# EAGLE design pcb_1 (EAGLE 5.06)
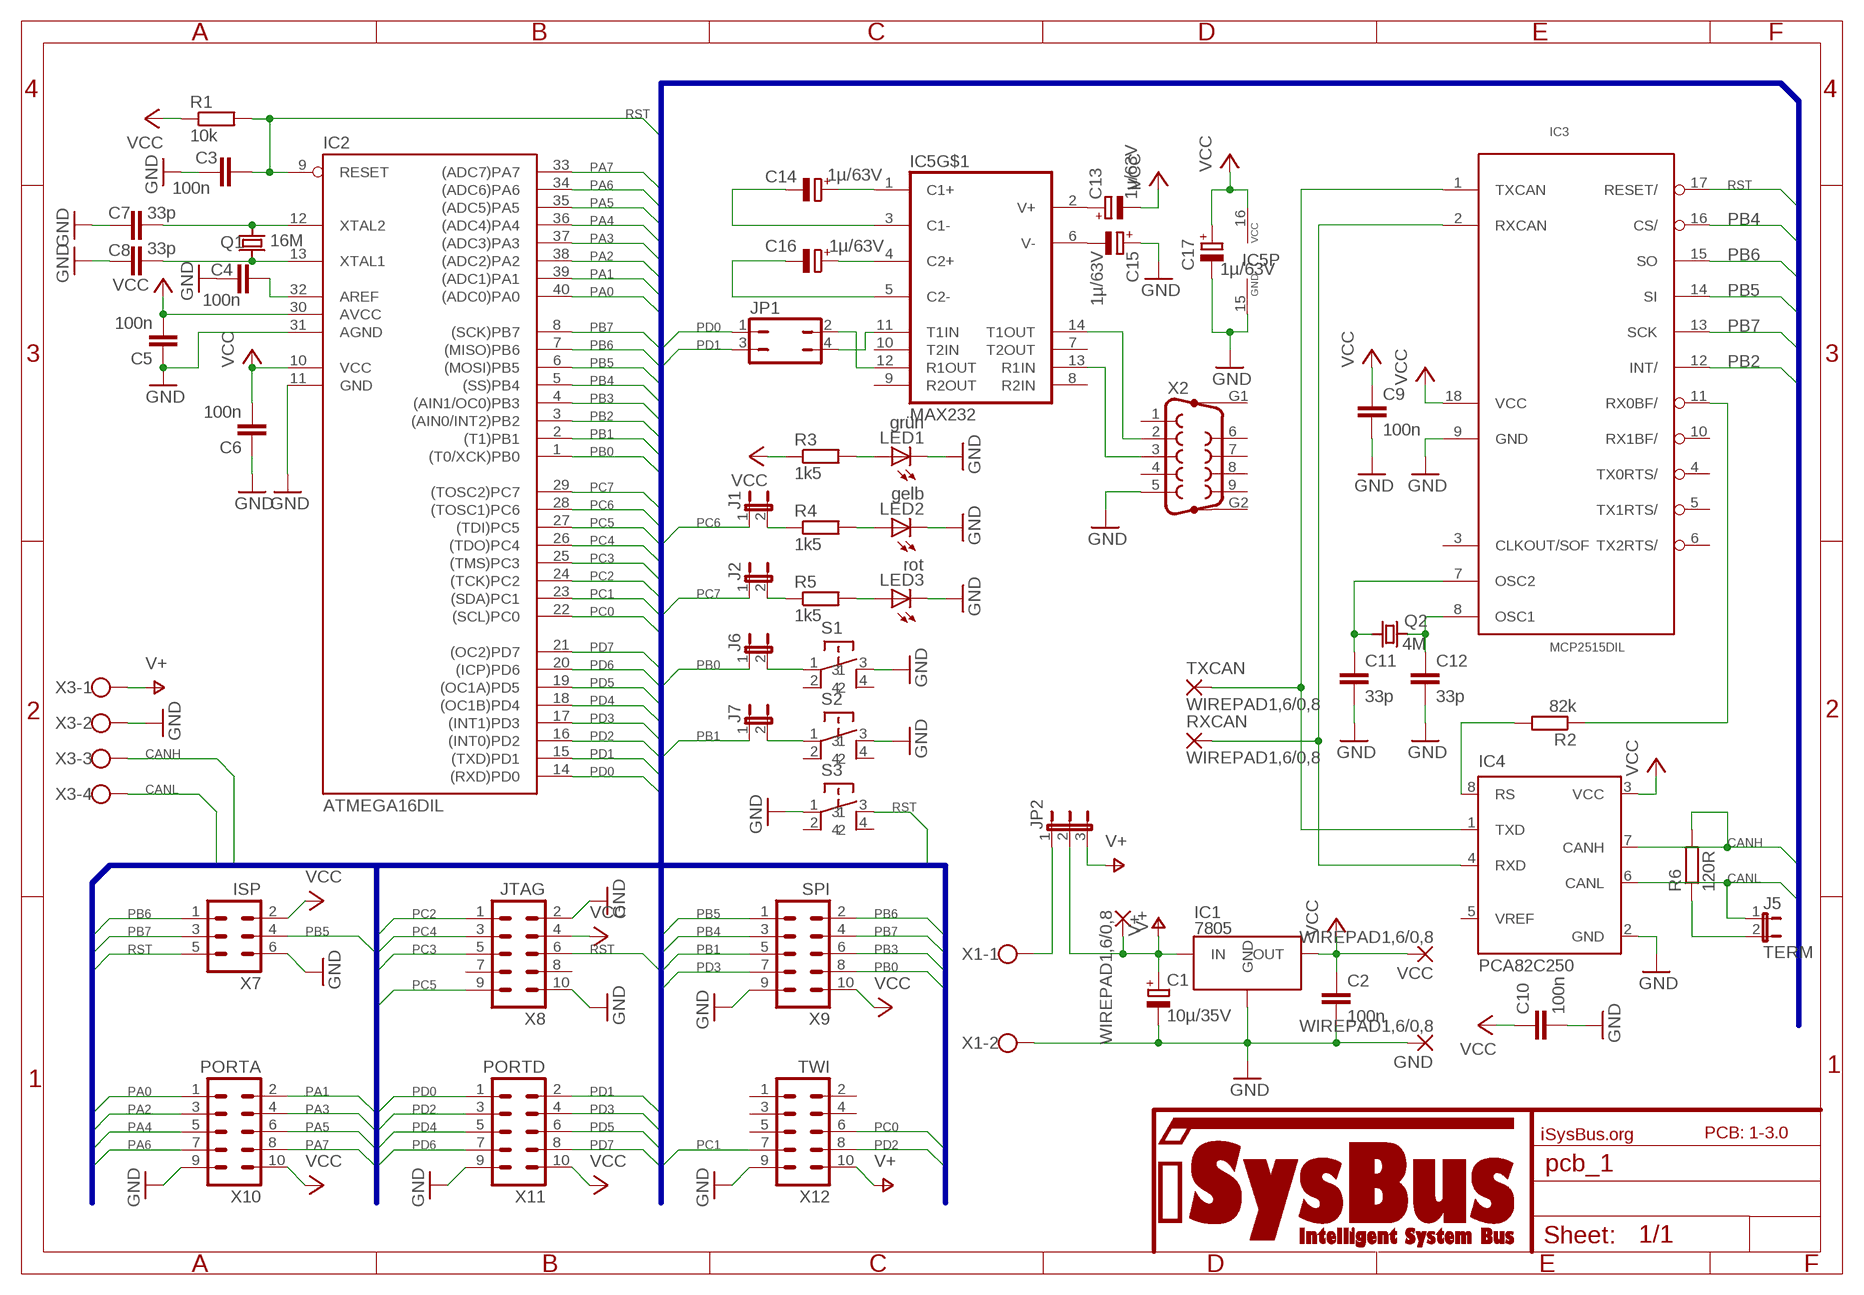
[diagram p0: schematic, sheet 1]

## Parts
C1  10µ/35V  CPOLE2-5  [E2-5]
C2  100n  C025-025X050  [C025-025X050]
C3  100n  C025-025X050  [C025-025X050]
C4  100n  C025-025X050  [C025-025X050]
C5  100n  C025-025X050  [C025-025X050]
C6  100n  C025-025X050  [C025-025X050]
C7  33p  C025-025X050  [C025-025X050]
C8  33p  C025-025X050  [C025-025X050]
C9  100n  C025-025X050  [C025-025X050]
C10  100n  C025-025X050  [C025-025X050]
C11  33p  C025-025X050  [C025-025X050]
C12  33p  C025-025X050  [C025-025X050]
C13  1µ/63V  CPOLE2.5-5  [E2,5-5]
C14  1µ/63V  CPOLE2.5-5  [E2,5-5]
C15  1µ/63V  CPOLE2.5-5  [E2,5-5]
C16  1µ/63V  CPOLE2.5-5  [E2,5-5]
C17  1µ/63V  CPOLE2.5-5  [E2,5-5]
GND  WIREPAD1,6/0,8  [1,6/0,8]
IC1  7805  [TO220]
IC2  ATMEGA16DIL  [DIL40]
IC3  MCP2515DIL  [DIL18]
IC4  PCA82C250  [DIL08]
IC5  MAX232  [DIL16]
J1  J1  [J1]
J2  J1  [J1]
J5  TERM  J1  [J1]
J6  J1  [J1]
J7  J1  [J1]
JP1  JP2Q  [JP2Q]
JP2  JP2E  [JP2]
LED1  grün  LED3MM  [LED3MM]
LED2  gelb  LED3MM  [LED3MM]
LED3  rot  LED3MM  [LED3MM]
Q1  16M  Q  [HC49U-V]
Q2  4M  Q  [HC49U-V]
R1  10k  R-0207/10  [0207/10]
R2  82k  R-0207/10  [0207/10]
R3  1k5  R-0207/10  [0207/10]
R4  1k5  R-0207/10  [0207/10]
R5  1k5  R-0207/10  [0207/10]
R6  120R  R-0207/10  [0207/10]
RXCAN  WIREPAD1,6/0,8  [1,6/0,8]
S1  PHAP3301  [PHAP3301]
S2  PHAP3301  [PHAP3301]
S3  PHAP3301  [PHAP3301]
TXCAN  WIREPAD1,6/0,8  [1,6/0,8]
U$1  ISYSBUS_LOGO  [ISYSBUS_LOGO]
U$2  1-3.0  FIELD_PCB_PLACE  [FIELD_PCB_PLACE]
U$6  FIELD_ISB_PLACE  [FIELD_ISB_PLACE]
V+  WIREPAD1,6/0,8  [1,6/0,8]
VCC  WIREPAD1,6/0,8  [1,6/0,8]
X1  AKL-02_101-02  [AKL-02]
X2  F09HP  [F09HP]
X3  AKL-04_101-04  [AKL-04]
X7  ISP  ML6  [ML6]
X8  JTAG  ML10  [ML10]
X9  SPI  ML10  [ML10]
X10  PORTA  ML10  [ML10]
X11  PORTD  ML10  [ML10]
X12  TWI  ML10  [ML10]

## Nets
CANH: IC4.7(CANH) R6.2 X3.3
CANL: IC4.6(CANL) J5.1 X3.4
GND: C1.- C2.2 C3.1 C4.1 C5.1 C6.1 C7.2 C8.2 C9.2 C10.2 C11.2 C12.2 C15.+ C17.- GND.1(P) IC1.2(GND) IC2.11(GND) IC2.31(AGND) IC3.9(GND) IC4.2(GND) IC5.15(P:GND) LED1.K(C) LED2.K(C) LED3.K(C) S1.3 S2.3 S3.1 X1.2 X2.5 X3.2 X7.6 X8.2 X8.10 X9.9 X10.9 X11.9 X12.9
N$1: IC5.13(R1IN) X2.3
N$2: IC5.14(T1OUT) X2.2
N$3: J5.2 R6.1
N$4: LED1.A R3.2
N$5: LED2.A R4.2
N$6: C4.2 IC2.32(AREF)
N$7: LED3.A R5.2
N$8: C8.1 IC2.13(XTAL1) Q1.2
N$9: C7.1 IC2.12(XTAL2) Q1.1
N$10: J1.2 R4.1
N$11: C12.1 IC3.8(OSC1) Q2.2
N$12: C11.1 IC3.7(OSC2) Q2.1
N$13: IC3.1(TXCAN) IC4.1(TXD) TXCAN.1(P)
N$14: IC3.2(RXCAN) IC4.4(RXD) RXCAN.1(P)
N$15: J2.2 R5.1
N$16: IC4.8(RS) R2.2
N$17: C14.+ IC5.1(C1+)
N$18: C16.+ IC5.4(C2+)
N$19: C14.- IC5.3(C1-)
N$20: C16.- IC5.5(C2-)
N$21: C13.+ IC5.2(V+)
N$22: C15.- IC5.6(V-)
N$23: IC5.12(R1OUT) JP1.2
N$24: IC5.11(T1IN) JP1.4
N$26: J7.2 S2.1
N$27: J6.2 S1.1
N$29: IC3.11(RX0BF/) R2.1
PA0: IC2.40((ADC0)PA0) X10.1
PA1: IC2.39((ADC1)PA1) X10.2
PA2: IC2.38((ADC2)PA2) X10.3
PA3: IC2.37((ADC3)PA3) X10.4
PA4: IC2.36((ADC4)PA4) X10.5
PA5: IC2.35((ADC5)PA5) X10.6
PA6: IC2.34((ADC6)PA6) X10.7
PA7: IC2.33((ADC7)PA7) X10.8
PB0: IC2.1((T0/XCK)PB0) J6.1 X9.8
PB1: IC2.2((T1)PB1) J7.1 X9.5
PB2: IC2.3((AIN0/INT2)PB2) IC3.12(INT/)
PB3: IC2.4((AIN1/OC0)PB3) X9.6
PB4: IC2.5((SS)PB4) IC3.16(CS/) X9.3
PB5: IC2.6((MOSI)PB5) IC3.14(SI) X7.4 X9.1
PB6: IC2.7((MISO)PB6) IC3.15(SO) X7.1 X9.2
PB7: IC2.8((SCK)PB7) IC3.13(SCK) X7.3 X9.4
PC0: IC2.22((SCL)PC0) X12.6
PC1: IC2.23((SDA)PC1) X12.7
PC2: IC2.24((TCK)PC2) X8.1
PC3: IC2.25((TMS)PC3) X8.5
PC4: IC2.26((TDO)PC4) X8.3
PC5: IC2.27((TDI)PC5) X8.9
PC6: IC2.28((TOSC1)PC6) J1.1
PC7: IC2.29((TOSC2)PC7) J2.1
PD0: IC2.14((RXD)PD0) JP1.1 X11.1
PD1: IC2.15((TXD)PD1) JP1.3 X11.2
PD2: IC2.16((INT0)PD2) X11.3 X12.8
PD3: IC2.17((INT1)PD3) X9.7 X11.4
PD4: IC2.18((OC1B)PD4) X11.5
PD5: IC2.19((OC1A)PD5) X11.6
PD6: IC2.20((ICP)PD6) X11.7
PD7: IC2.21((OC2)PD7) X11.8
RST: C3.2 IC2.9(RESET) IC3.17(RESET/) R1.2 S3.3 X7.5 X8.6
V+: C1.+ IC1.1(IN) JP2.2 V+.1(P) X12.10
VBUS: JP2.3 X3.1 ; supply symbol labelled V+
VCC: C2.1 C5.2 C6.2 C9.1 C10.1 C13.- C17.+ IC1.3(OUT) IC2.10(VCC) IC2.30(AVCC) IC3.18(VCC) IC4.3(VCC) IC5.16(P:VCC) R1.1 R3.1 VCC.1(P) X7.2 X8.4 X9.10 X10.10 X11.10
VEXT: JP2.1 X1.1
Unconnected: IC3.3(CLKOUT/SOF) IC3.4(TX0RTS/) IC3.5(TX1RTS/) IC3.6(TX2RTS/) IC3.10(RX1BF/) IC4.5(VREF) IC5.7(T2OUT) IC5.8(R2IN) IC5.9(R2OUT) IC5.10(T2IN) S1.2 S1.4 S2.2 S2.4 S3.2 S3.4 X2.1 X2.4 X2.6 X2.7 X2.8 X2.9 X2.G1 X2.G2 X8.7 X8.8 X12.1 X12.2 X12.3 X12.4 X12.5

## Buses
RST,PA[0..7],PB[0..7],PC[0..7],PD[0..7],CANH,CANL

## Library data of the parts
C1 C13-C17 = isb_capacitors:CPOL: POLARIZED CAPACITOR, European symbol
C2-C12 = isb_capacitors:C: CAPACITOR, European symbol
GND RXCAN TXCAN V+ VCC = isb_connectors:WIREPAD: Wire PAD connect wire on PCB
IC1 = isb_supply:7805
IC2 = isb_microcontrollers:ATMEGA16DIL
IC3 = isb_interfacecontrollers:MCP2515
IC4 = isb_interfacecontrollers:PCA82C250
IC5 = isb_interfacecontrollers:MAX232: RS232 TRANSEIVER
J1 J2 J5-J7 = isb_connectors:J1: JUMPER
JP1 = jumper:JP2Q: JUMPER
JP2 = jumper:JP2E: JUMPER
LED1-LED3 = isb_optical:LED
Q1 Q2 = isb_oscillators:Q
R1-R6 = isb_resistors:R: RESISTOR, European symbol
S1-S3 = isb_buttons:PHAP3301
U$1 = isysbus_misc:ISYSBUS_LOGO: iSysBus Logo
U$2 = isb_misc:FIELD_PCB
U$6 = isb_misc:FIELD_ISB
X1 = isb_connectors:AKL-02_: WAGO SREW CLAMP
X2 = isb_connectors:F09HP: SUB-D
X3 = isb_connectors:AKL-04_: WAGO SREW CLAMP
X7 = isb_connectors:ML6: HARTING
X8-X12 = isb_connectors:ML10: HARTING

## Board
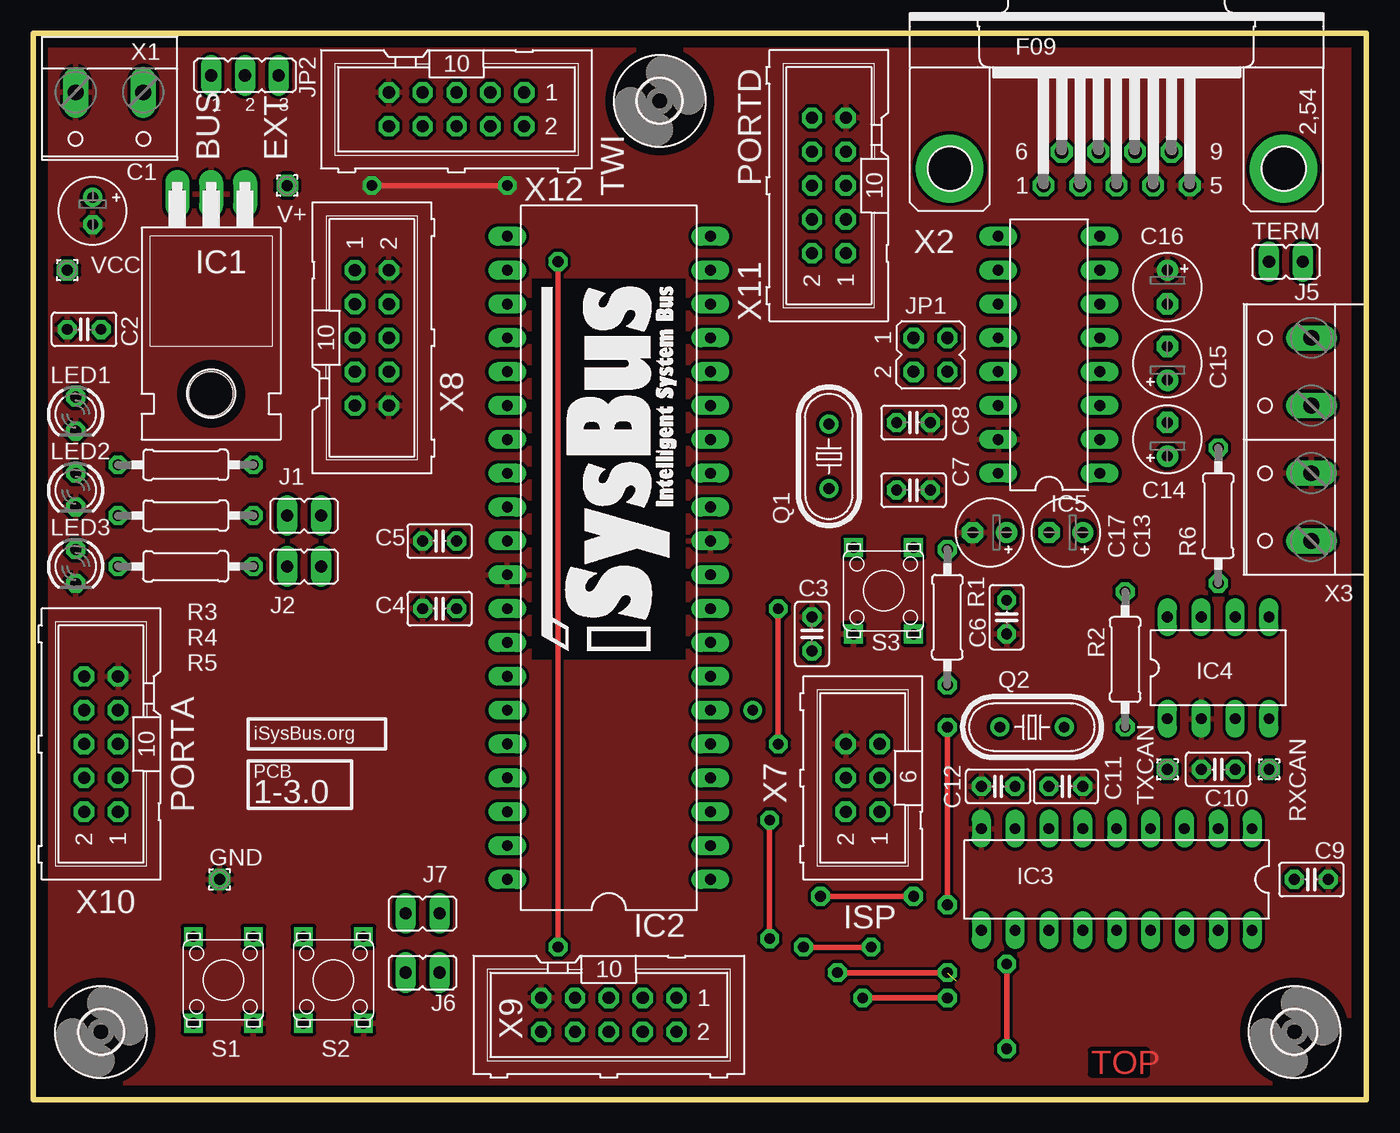
[diagram p1: board, top side]
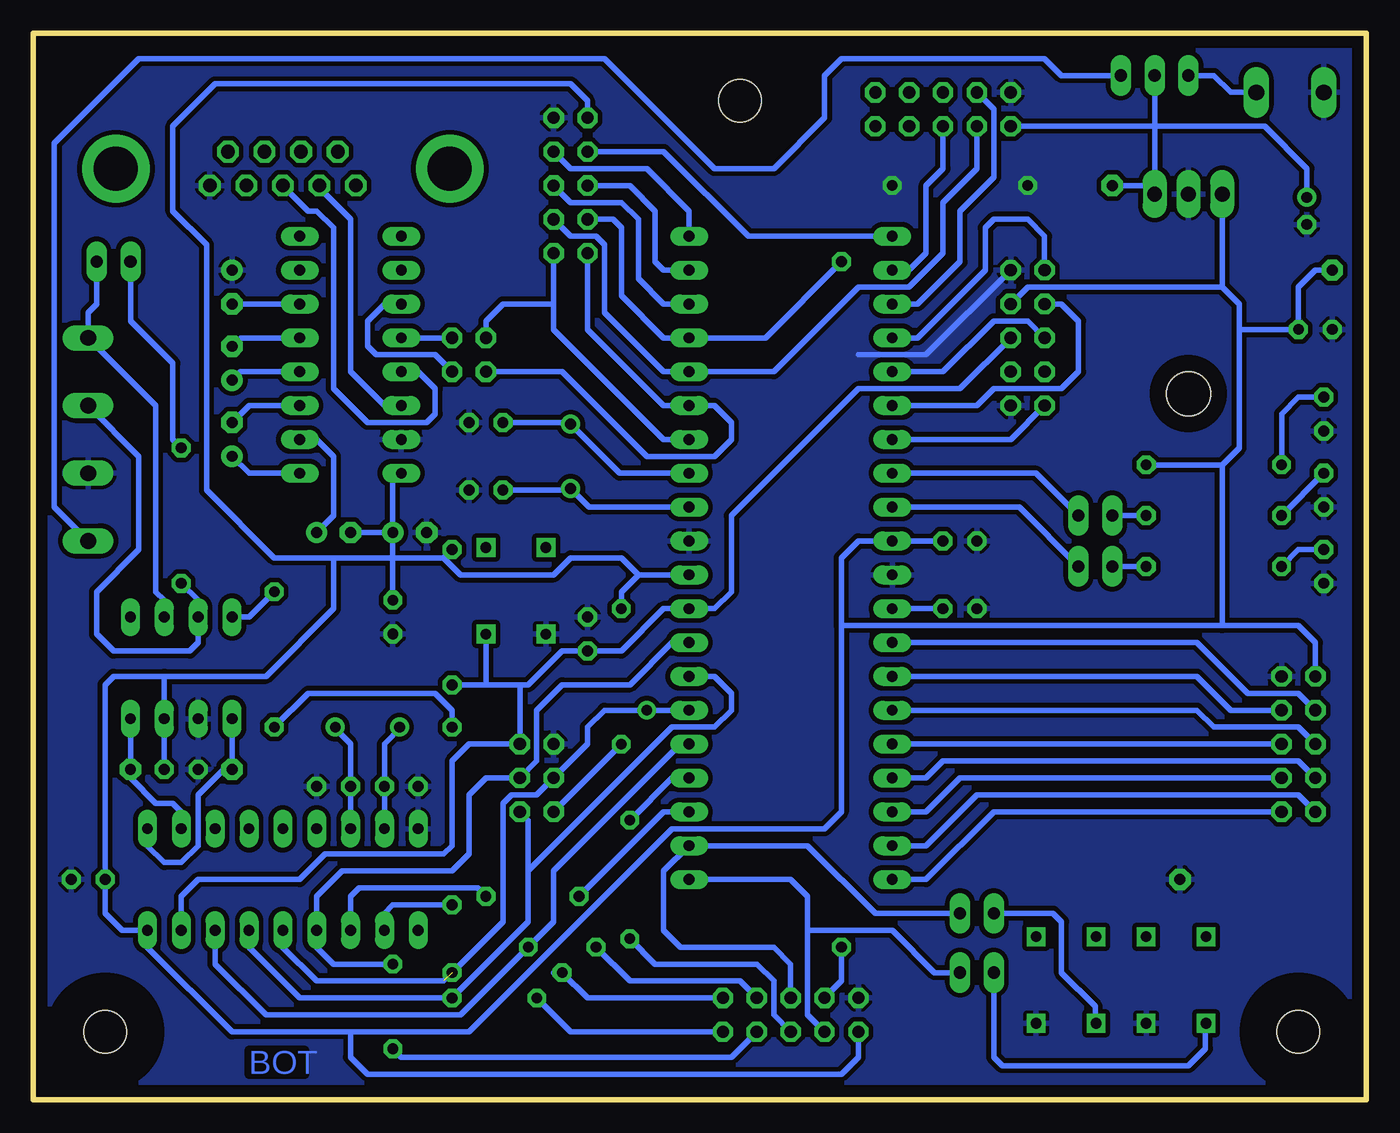
[diagram p2: board, bottom side, seen from below]

Size 100 x 80 mm. Coordinates in mm from the lower left corner, seen from the top.
Outline: 0,0 100,0 100,80 0,80 0,0
Copper layers (1*16): Top 0.035mm / dielectric 1.5mm / Bottom 0.035mm
Design rules "hausbus": minimum track width 12mil, minimum drill 31mil, track to track 10mil, track to pad 10mil, pad to pad 10mil, via to via 10mil, smd to smd 8mil, copper to edge 35mil, drill to drill 8mil, minimum pad ring 12mil, minimum via ring 12mil, stop-mask expansion 4mil, vias tented up to drill 0mil, thermal gap 10mil
Milling: 4 lines

### Footprints (pad centres in the part's own frame; a part is rotated, then mirrored left to right if it is on the bottom)
E2-5 = drill 0.813 pad 1.27 round: + -1.016,0 | drill 0.813 pad 1.27 octagon: - 1.016,0
C025-025X050 = drill 0.813 octagon: 1 -1.27,0; 2 1.27,0
E2,5-5 = drill 0.813 pad 1.6 round: + -1.27,0 | drill 0.813 pad 1.6 octagon: - 1.27,0
1,6/0,8 = drill 0.813 pad 1.6 octagon: 1 0,0
TO220 = drill 1.118 long: 1 -2.54,-10.16; 2 0,-10.16; 3 2.54,-10.16 | hole 3.302: 0,4.826
DIL40 = drill 0.813 long: 1 -24.13,-7.62; 2 -21.59,-7.62; 3 -19.05,-7.62; 4 -16.51,-7.62; 5 -13.97,-7.62; 6 -11.43,-7.62; 7 -8.89,-7.62; 8 -6.35,-7.62; 9 -3.81,-7.62; 10 -1.27,-7.62; 11 1.27,-7.62; 12 3.81,-7.62; 13 6.35,-7.62; 14 8.89,-7.62; 15 11.43,-7.62; 16 13.97,-7.62; 17 16.51,-7.62; 18 19.05,-7.62; 19 21.59,-7.62; 20 24.13,-7.62; 21 24.13,7.62; 22 21.59,7.62; 23 19.05,7.62; 24 16.51,7.62; 25 13.97,7.62; 26 11.43,7.62; 27 8.89,7.62; 28 6.35,7.62; 29 3.81,7.62; 30 1.27,7.62; 31 -1.27,7.62; 32 -3.81,7.62; 33 -6.35,7.62; 34 -8.89,7.62; 35 -11.43,7.62; 36 -13.97,7.62; 37 -16.51,7.62; 38 -19.05,7.62; 39 -21.59,7.62; 40 -24.13,7.62
DIL18 = drill 0.813 long: 1 -10.16,-3.81; 2 -7.62,-3.81; 3 -5.08,-3.81; 4 -2.54,-3.81; 5 0,-3.81; 6 2.54,-3.81; 7 5.08,-3.81; 8 7.62,-3.81; 9 10.16,-3.81; 10 10.16,3.81; 11 7.62,3.81; 12 5.08,3.81; 13 2.54,3.81; 14 0,3.81; 15 -2.54,3.81; 16 -5.08,3.81; 17 -7.62,3.81; 18 -10.16,3.81
DIL08 = drill 0.813 long: 1 -3.81,-3.81; 2 -1.27,-3.81; 3 1.27,-3.81; 4 3.81,-3.81; 5 3.81,3.81; 6 1.27,3.81; 7 -1.27,3.81; 8 -3.81,3.81
DIL16 = drill 0.813 long: 1 -8.89,-3.81; 2 -6.35,-3.81; 3 -3.81,-3.81; 4 -1.27,-3.81; 5 1.27,-3.81; 6 3.81,-3.81; 7 6.35,-3.81; 8 8.89,-3.81; 9 8.89,3.81; 10 6.35,3.81; 11 3.81,3.81; 12 1.27,3.81; 13 -1.27,3.81; 14 -3.81,3.81; 15 -6.35,3.81; 16 -8.89,3.81
J1 = drill 0.914 long: 1 0,-1.27; 2 0,1.27
JP2Q = drill 0.914 octagon: 1 -1.27,-1.27; 2 -1.27,1.27; 3 1.27,-1.27; 4 1.27,1.27
JP2 = drill 0.914 long: 1 -2.54,0; 2 0,0; 3 2.54,0
LED3MM = drill 0.813 octagon: A -1.27,0; K 1.27,0
HC49U-V = drill 0.813 round: 1 -2.413,0; 2 2.413,0
0207/10 = drill 0.813 octagon: 1 -5.08,0; 2 5.08,0
PHAP3301 = drill 0.8 square: 1 0,4.5; 2 6.5,4.5; 3 0,0; 4 6.5,0
3,2 = hole 3.2: 0,0
AKL-02 = drill 1.194 long: 1 -2.54,-0.635; 2 2.54,-0.635
F09HP = drill 1.016 octagon: 1 -5.486,-1.27; 2 -2.743,-1.27; 3 0,-1.27; 4 2.743,-1.27; 5 5.486,-1.27; 6 -4.115,1.27; 7 -1.372,1.27; 8 1.372,1.27; 9 4.115,1.27 | drill 3.302 pad 5.08 round: G1 -12.522,0; G2 12.522,0
AKL-04 = drill 1.194 long: 1 -7.62,-0.635; 2 -2.54,-0.635; 3 2.54,-0.635; 4 7.62,-0.635
ML6 = drill 0.914 octagon: 1 -2.54,-1.27; 2 -2.54,1.27; 3 0,-1.27; 4 0,1.27; 5 2.54,-1.27; 6 2.54,1.27
ML10 = drill 0.914 octagon: 1 -5.08,-1.27; 2 -5.08,1.27; 3 -2.54,-1.27; 4 -2.54,1.27; 5 0,-1.27; 6 0,1.27; 7 2.54,-1.27; 8 2.54,1.27; 9 5.08,-1.27; 10 5.08,1.27

### Placement (x,y rotation side)
C1  4.45,66.67 270 top
C2  3.81,57.78 180 top
C3  58.42,34.92 270 top
C4  30.48,36.83 0 top
C5  30.48,41.91 0 top
C6  73.03,36.2 90 top
C7  66.04,45.72 0 top
C8  66.04,50.8 0 top
C9  95.89,16.51 0 top
C10  88.9,24.77 180 top
C11  77.47,23.5 0 top
C12  72.39,23.5 180 top
C13  77.47,42.55 180 top
C14  85.09,49.53 90 top
C15  85.09,60.96 270 top
C16  85.09,55.24 90 top
C17  71.75,42.55 180 top
GND  13.97,16.51 0 top
IC1  13.34,57.78 180 top
IC2  43.18,40.64 90 top
IC3  81.28,16.51 180 top
IC4  88.9,32.38 0 top
IC5  76.2,55.88 90 top
J1  20.32,43.81 90 top
J2  20.32,40.01 90 top
J5  93.98,62.87 90 top
J6  29.21,9.53 90 top
J7  29.21,13.97 90 top
JP1  67.31,55.88 270 top
JP2  15.88,76.83 0 top
LED1  3.17,51.44 270 top
LED2  3.17,45.72 270 top
LED3  3.17,40.01 270 top
Q1  59.69,48.26 90 top
Q2  74.93,27.94 180 top
R1  68.58,36.2 270 top
R2  81.92,33.02 90 top
R3  11.43,47.62 180 top
R4  11.43,43.81 180 top
R5  11.43,40.01 180 top
R6  88.9,43.81 270 top
RXCAN  92.71,24.77 0 top
S1  16.51,5.71 90 top
S2  24.77,5.71 90 top
S3  66.04,34.92 90 top
TXCAN  85.09,24.77 0 top
U$1  48.26,33.66 90 top
U$2  16.51,22.23 0 top
U$3  [3,2]  46.99,74.93 0 top
U$4  [3,2]  94.61,5.08 0 top
U$5  [3,2]  5.08,5.08 0 top
U$6  16.51,25.4 0 top
V+  19.05,68.58 0 top
VCC  2.54,62.23 0 top
X1  5.71,74.93 180 top
X2  81.28,69.85 0 top
X3  95.25,49.53 90 top
X7  62.23,24.13 90 top
X8  25.4,57.15 270 top
X9  43.18,6.35 180 top
X10  5.08,26.67 90 top
X11  59.69,68.58 90 top
X12  31.75,74.3 180 top

### Tracks (layer width: path | path; a pad name or v marks a point on that pad's centre or on a via)
CANH
  Bottom 0.406: X3.3 92.08,48.26 92.08,41.27 95.25,38.1 95.25,34.92 93.98,33.66 88.27,33.66 87.63,34.29 IC4.7 87.63,37.47 R6.2
CANL
  Bottom 0.406: IC4.6 90.17,37.47 90.81,38.1 90.81,52.07 X3.4 95.89,59.05 95.25,59.69 J5.1
GND  (via drill 0.8)
  Top 0.406: v25.4,68.58 v35.56,68.58
  Bottom 0.406: X8.2 33.02,55.88 38.1,55.88
  pour Bottom (isolate 0.356): 101,-1 101,81 -1,81 -1,-1
  pour Top: -1.27,81.28 100.97,81.28 100.97,-1.27 -1.27,-1.27
N$1
  Bottom 0.406: IC5.13 71.12,54.61 69.85,53.34 69.85,51.44 70.48,50.8 74.93,50.8 77.47,53.34 77.47,65.41 78.74,66.67 79.38,66.67 X2.3
N$2
  Bottom 0.406: IC5.14 73.66,52.07 76.2,54.61 76.2,66.04 78.54,68.38 X2.2
N$3
  Bottom 0.406: R6.1 89.53,49.53 89.53,55.24 92.71,58.42 J5.2
N$4
  Bottom 0.406: LED1.A 5.08,52.7 6.35,51.44 R3.2
N$5
  Bottom 0.406: LED2.A R4.2
N$6
  Bottom 0.406: C4.2 IC2.32
N$7
  Bottom 0.406: LED3.A 5.08,41.27 R5.2
N$8
  Bottom 0.406: C8.1 59.82,50.8 Q1.2 56.01,46.99 IC2.13
N$9
  Bottom 0.406: C7.1 59.82,45.72 Q1.1 58.29,44.45 IC2.12
N$10
  Bottom 0.406: R4.1 J1.2
N$11
  Bottom 0.406: IC3.8 C12.1 73.66,26.67 72.39,27.94 Q2.2
N$12
  Bottom 0.406: IC3.7 C11.1 76.2,26.67 77.47,27.94 Q2.1
N$13
  Bottom 0.406: IC3.1 91.44,19.05 90.17,17.78 88.9,17.78 87.63,19.05 87.63,22.86 85.72,24.77 | 85.72,24.77 85.09,25.4 IC4.1 | 85.72,24.77 TXCAN.1
N$14
  Bottom 0.406: IC3.2 88.9,21.59 89.53,22.23 90.81,22.23 92.71,24.13 RXCAN.1 92.71,25.4 IC4.4
N$15
  Bottom 0.406: R5.1 J2.2
N$16
  Bottom 0.406: IC4.8 83.82,36.2 R2.2
N$17
  Bottom 0.406: IC5.1 83.82,46.99 C14.+
N$18
  Bottom 0.406: IC5.4 84.45,54.61 C16.+
N$19
  Bottom 0.406: IC5.3 83.82,52.07 C14.-
N$20
  Bottom 0.406: IC5.5 84.45,57.15 C16.-
N$21
  Bottom 0.406: C13.+ 77.47,43.81 77.47,48.26 78.74,49.53 IC5.2
N$22
  Bottom 0.406: IC5.6 C15.-
N$23
  Bottom 0.406: JP1.2 IC5.12
N$24
  Bottom 0.406: JP1.4 69.85,55.88 74.3,55.88 74.93,56.52 74.93,58.42 73.66,59.69 IC5.11
N$26
  Bottom 0.406: S2.1 20.32,5.71 20.32,6.99 22.86,9.53 22.86,13.34 23.5,13.97 J7.2
N$27
  Bottom 0.406: S1.1 12.06,5.71 12.06,3.81 13.34,2.54 27.3,2.54 27.94,3.17 J6.2
N$29  (via drill 0.8)
  Top 0.406: v68.58,14.61 v68.58,27.94
  Bottom 0.406: R2.1 79.38,30.48 69.85,30.48 68.58,29.21 v68.58,27.94 | IC3.11 73.66,13.97 73.03,14.61 v68.58,14.61
PA0
  Bottom 0.406: IC2.40 33.02,16.51 27.94,21.59 X10.1
PA1
  Bottom 0.406: IC2.39 33.02,19.05 29.21,22.86 5.08,22.86 X10.2
PA2
  Bottom 0.406: IC2.38 33.02,21.59 30.48,24.13 X10.3
PA3
  Bottom 0.406: IC2.37 33.02,24.13 31.75,25.4 5.08,25.4 X10.4
PA4
  Bottom 0.406: X10.5 IC2.36
PA5
  Bottom 0.406: IC2.35 12.7,29.21 11.43,27.94 5.08,27.94 X10.6
PA6
  Bottom 0.406: IC2.34 12.7,31.75 10.16,29.21 X10.7
PA7
  Bottom 0.406: IC2.33 12.7,34.29 8.89,30.48 5.08,30.48 X10.8
PB0
  Bottom 0.406: IC2.1 43.18,16.51 41.91,15.24 41.91,12.7 | 41.91,12.7 41.91,6.35 X9.8 | 41.91,12.7 35.56,12.7 32.38,9.53 J6.1
PB1
  Bottom 0.406: X9.5 43.18,10.16 44.45,11.43 51.44,11.43 52.7,12.7 52.7,17.14 IC2.2 41.91,19.05 36.83,13.97 J7.1
PB2  (via drill 0.8)
  Top 0.406: v59.05,15.24 v66.04,15.24
  Bottom 0.406: IC2.3 52.7,21.59 v59.05,15.24 | IC3.12 76.2,15.24 75.56,15.88 66.67,15.88 v66.04,15.24
PB3  (via drill 0.8)
  Top 0.406: v55.24,12.06 v55.24,20.95
  Bottom 0.406: v55.24,12.06 53.34,10.16 45.72,10.16 44.45,8.89 44.45,6.35 X9.6 | v55.24,20.95 52.07,24.13 IC2.4
PB4  (via drill 0.8)
  Top 0.406: v57.78,11.43 v62.87,11.43
  Bottom 0.406: IC3.16 86.36,10.16 82.55,6.35 67.94,6.35 v62.87,11.43 60.96,13.34 60.96,17.14 51.44,26.67 IC2.5 | X9.3 46.99,8.89 55.24,8.89 v57.78,11.43
PB5  (via drill 0.8)  (1 unrouted)
  Top 0.406: v60.33,9.53 v68.58,9.53
  Bottom 0.406: IC2.6 v53.98,29.21 57.15,29.21 58.42,27.94 58.42,26.67 X7.4 62.23,22.86 64.14,22.86 64.77,22.23 64.77,13.34 v68.58,9.53 69.22,8.89 78.74,8.89 81.28,11.43 IC3.14 | X9.1 58.42,7.62 v60.33,9.53 60.96,9.53
PB6  (via drill 0.8)
  Top 0.406: v62.23,7.62 v68.58,7.62
  Bottom 0.406: IC2.7 48.9,31.75 47.62,30.48 47.62,29.21 48.9,27.94 52.07,27.94 62.87,17.14 | IC3.15 83.82,11.43 80.01,7.62 v68.58,7.62 62.87,13.34 62.87,17.14 | 62.87,17.14 62.87,20.95 X7.1 | X9.2 59.69,5.08 v62.23,7.62
PB7  (via drill 0.8)
  Top 0.406: v73.03,3.81 v73.03,10.16
  Bottom 0.406: IC2.8 52.07,34.29 55.24,31.11 60.33,31.11 62.23,29.21 62.23,25.4 X7.3 66.04,24.13 67.31,22.86 67.31,18.41 68.58,17.14 76.83,17.14 78.74,15.24 IC3.13 78.74,11.43 77.47,10.16 v73.03,10.16 | X9.4 47.62,3.17 72.39,3.17 v73.03,3.81
PC0
  Bottom 0.406: IC2.22 34.29,62.23 33.02,63.5 33.02,68.58 31.75,69.85 X12.6
PC1
  Bottom 0.406: IC2.23 33.66,59.69 30.48,62.87 30.48,66.67 27.94,69.22 27.94,74.3 X12.7
PC2
  Bottom 0.406: IC2.24 33.66,57.15 28.57,62.23 28.57,65.41 27.94,66.04 25.4,66.04 24.13,64.77 X8.1
PC3
  Bottom 0.406: IC2.25 31.75,54.61 27.94,58.42 25.4,58.42 X8.5
PC4
  Bottom 0.406: IC2.26 29.21,52.07 27.94,53.34 22.86,53.34 21.59,54.61 21.59,58.42 22.86,59.69 X8.3
PC5
  Bottom 0.406: IC2.27 26.67,49.53 X8.9
PC6
  Bottom 0.406: IC2.28 24.77,46.99 J1.1
PC7
  Bottom 0.406: IC2.29 26.04,44.45 J2.1
PD0
  Bottom 0.406: 60.96,59.69 X11.1 | 60.96,59.69 64.77,59.69 66.04,58.42 JP1.1 | IC2.14 52.7,49.53 60.96,57.78 60.96,59.69
PD1
  Bottom 0.406: X11.2 58.42,57.78 52.7,52.07 IC2.15 48.9,52.07 47.62,50.8 47.62,49.53 48.9,48.26 53.98,48.26 60.33,54.61 JP1.3
PD2
  Bottom 0.406: X12.8 29.21,69.85 31.75,67.31 31.75,63.5 34.29,60.96 38.1,60.96 44.45,54.61 IC2.16 52.7,54.61 57.15,59.05 57.15,64.14 57.78,64.77 59.69,64.77 X11.3
PD3  (via drill 0.8)
  Top 0.406: v39.37,11.43 v39.37,62.87
  Bottom 0.406: v39.37,62.87 45.09,57.15 IC2.17 52.7,57.15 55.88,60.33 55.88,65.41 56.52,66.04 X11.4 | v39.37,11.43 39.37,8.89 X9.7
PD4
  Bottom 0.406: IC2.18 52.7,59.69 54.61,61.59 54.61,66.04 55.88,67.31 59.69,67.31 X11.5
PD5
  Bottom 0.406: X11.6 55.24,68.58 53.34,66.67 53.34,62.87 52.7,62.23 IC2.19
PD6
  Bottom 0.406: IC2.20 50.8,66.67 53.98,69.85 59.69,69.85 X11.7
PD7
  Bottom 0.406: IC2.21 46.35,64.77 52.7,71.12 X11.8
RST
  Bottom 0.406: IC3.17 88.9,15.24 87.63,16.51 80.01,16.51 78.11,18.41 69.22,18.41 68.58,19.05 68.58,25.4 67.31,26.67 X7.5 63.5,31.11 | X8.6 30.48,53.34 38.1,53.34 47.62,43.81 47.62,38.1 48.9,36.83 IC2.9 52.7,36.83 55.88,33.66 C3.2 60.33,33.66 62.87,31.11 63.5,31.11 | 63.5,31.11 66.04,31.11 | 66.04,31.11 R1.2 | 66.04,31.11 S3.3
V+
  Bottom 0.406: 15.88,68.58 V+.1 | C1.+ 4.45,69.85 7.62,73.03 15.88,73.03 | 15.88,73.03 15.88,68.58 | 15.88,68.58 IC1.1 | 15.88,73.03 X12.10 | JP2.2 15.88,73.03
VBUS
  Bottom 0.406: X3.1 98.42,44.45 98.42,71.75 92.08,78.11 57.15,78.11 48.9,69.85 44.45,69.85 40.64,73.66 40.64,76.83 | 40.64,76.83 40.01,77.47 | JP2.3 22.86,76.83 24.13,78.11 39.37,78.11 40.64,76.83
VCC  (via drill 0.8)
  Top 0.406: v55.88,36.83 v55.88,26.67
  Bottom 0.406: 54.61,39.37 IC2.10 | 54.61,39.37 55.88,40.64 59.69,40.64 60.96,39.37 67.94,39.37 69.22,40.64 | v55.88,36.83 55.88,38.1 54.61,39.37 | 90.17,31.75 93.98,31.75 94.61,31.11 C9.1 94.61,13.97 93.34,12.7 IC3.18 91.44,11.43 85.09,5.08 76.2,5.08 | 90.17,31.75 IC4.3 C10.1 | 90.17,31.75 82.55,31.75 77.47,36.83 77.47,40.64 | C17.+ C13.- | IC5.16 73.03,46.35 C17.+ | 73.03,40.64 C17.+ | 76.2,5.08 67.31,5.08 52.07,20.32 40.64,20.32 39.37,21.59 39.37,35.56 | 39.37,35.56 39.37,40.64 38.1,41.91 IC2.30 C5.2 | 77.47,40.64 73.03,40.64 | 76.2,5.08 76.2,3.17 74.93,1.91 39.37,1.91 38.1,3.17 X9.10 | v55.88,26.67 X7.2 | X11.10 58.42,74.93 59.69,76.2 86.36,76.2 89.53,73.03 89.53,66.67 87,64.14 87,45.72 81.92,40.64 77.47,40.64 | X8.4 25.4,60.96 10.79,60.96 | 73.03,40.64 C6.2 | 69.22,40.64 R1.1 | 73.03,40.64 69.22,40.64 | 10.79,35.56 5.08,35.56 3.81,34.29 X10.10 | 10.79,35.56 39.37,35.56 | 10.79,35.56 10.79,47.62 | 10.79,47.62 R3.1 | 10.79,47.62 9.53,48.9 9.53,57.78 | 9.53,57.78 9.53,59.69 10.79,60.96 | 10.79,60.96 IC1.3 | 9.53,57.78 C2.1 5.08,60.96 3.81,62.23 VCC.1
VEXT
  Bottom 0.406: JP2.1 11.43,76.83 10.16,75.56 X1.1

### Text on the board
Top: TOP
Bottom: BOT
tNames: BUS | EXT